# Altium schematic sheet AtoD_PART.SchDoc
size A4; SheetNumber: 3; SheetTotal: 3
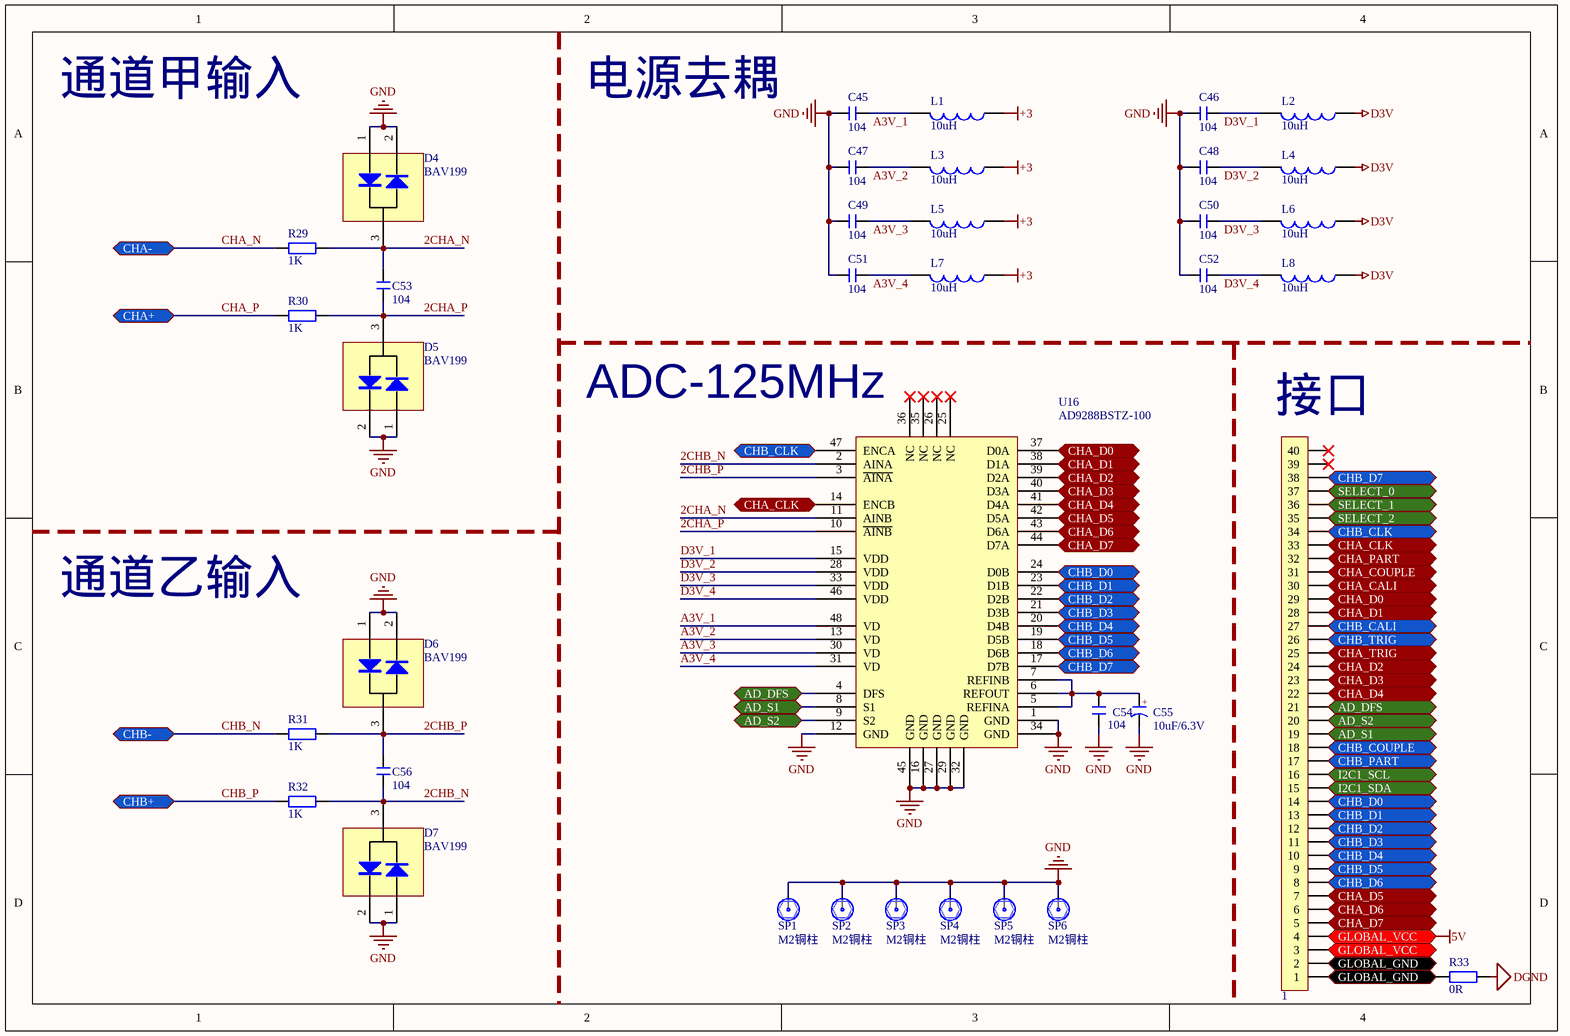
[diagram p0: AtoD_PART.SchDoc]

## Parts
1  FPC1.0-40P  [FPC0.5 2H-WS-40P]  (value not drawn)
C45  104  [C 0603_L]
C46  104  [C 0603_L]
C47  104  [C 0603_L]
C48  104  [C 0603_L]
C49  104  [C 0603_L]
C50  104  [C 0603_L]
C51  104  [C 0603_L]
C52  104  [C 0603_L]
C53  104  [C 0603_L]
C54  104  [C 0603_L]
C55  10uF/6.3V  [C 0603_L]
C56  104  [C 0603_L]
D4  BAV199  [SOT23-3L]
D5  BAV199  [SOT23-3L]
D6  BAV199  [SOT23-3L]
D7  BAV199  [SOT23-3L]
L1  10uH  [L 0603_L]
L2  10uH  [L 0603_L]
L3  10uH  [L 0603_L]
L4  10uH  [L 0603_L]
L5  10uH  [L 0603_L]
L6  10uH  [L 0603_L]
L7  10uH  [L 0603_L]
L8  10uH  [L 0603_L]
R29  1K  [R 0603_L]
R30  1K  [R 0603_L]
R31  1K  [R 0603_L]
R32  1K  [R 0603_L]
R33  0R  [R 0603_L]
SP1  M2铜柱  [M2]
SP2  M2铜柱  [M2]
SP3  M2铜柱  [M2]
SP4  M2铜柱  [M2]
SP5  M2铜柱  [M2]
SP6  M2铜柱  [M2]
U16  AD9288BSTZ-100  [TQFP48 7x7_L]

## Ports
AD_DFS (bidir), AD_S1 (bidir), AD_S2 (bidir), CHA+ (bidir), CHA- (bidir), CHA_CALI (bidir), CHA_CLK (bidir), CHA_COUPLE (bidir), CHA_D0 (bidir), CHA_D1 (bidir), CHA_D2 (bidir), CHA_D3 (bidir), CHA_D4 (bidir), CHA_D5 (bidir), CHA_D6 (bidir), CHA_D7 (bidir), CHA_PART (bidir), CHA_TRIG (bidir), CHB+ (bidir), CHB- (bidir), CHB_CALI (bidir), CHB_CLK (bidir), CHB_COUPLE (bidir), CHB_D0 (bidir), CHB_D1 (bidir), CHB_D2 (bidir), CHB_D3 (bidir), CHB_D4 (bidir), CHB_D5 (bidir), CHB_D6 (bidir), CHB_D7 (bidir), CHB_PART (bidir), CHB_TRIG (bidir), GLOBAL_GND (bidir), GLOBAL_VCC (bidir), I2C1_SCL (bidir), I2C1_SDA (bidir), SELECT_0 (bidir), SELECT_1 (bidir), SELECT_2 (bidir)

## Nets
5V: 1.3 1.4 ; port GLOBAL_VCC
+3: L1.1 L3.1 L5.1 L7.1
D3V: L2.1 L4.1 L6.1 L8.1
DGND: R33.1
GND: C45.1 C46.1 C47.1 C48.1 C49.1 C50.1 C51.1 C52.1 C54.1 C55.2(K) D4.1 D4.2 D5.1 D5.2 D6.1 D6.2 D7.1 D7.2 SP1.1 SP2.1 SP3.1 SP4.1 SP5.1 SP6.1 U16.1(GND) U16.12(GND) U16.16(GND) U16.27(GND) U16.29(GND) U16.32(GND) U16.34(GND) U16.45(GND)
2CHA_N: C53.1 D4.3 R29.2 U16.11(AINB)
2CHA_P: C53.2 D5.3 R30.2 U16.10(~{AINB})
2CHB_N: C56.2 D7.3 R32.2 U16.2(AINA)
2CHB_P: C56.1 D6.3 R31.2 U16.3(~{AINA})
A3V_1: C45.2 L1.2 U16.48(VD)
A3V_2: C47.2 L3.2 U16.13(VD)
A3V_3: C49.2 L5.2 U16.30(VD)
A3V_4: C51.2 L7.2 U16.31(VD)
AD_DFS: 1.21 U16.4(DFS) ; port AD_DFS
AD_S1: 1.19 U16.8(S1) ; port AD_S1
AD_S2: 1.20 U16.9(S2) ; port AD_S2
CHA_CALI: 1.30 ; port CHA_CALI
CHA_CLK: 1.33 U16.14(ENCB) ; port CHA_CLK
CHA_COUPLE: 1.31 ; port CHA_COUPLE
CHA_D0: 1.29 U16.37(D0A) ; port CHA_D0
CHA_D1: 1.28 U16.38(D1A) ; port CHA_D1
CHA_D2: 1.24 U16.39(D2A) ; port CHA_D2
CHA_D3: 1.23 U16.40(D3A) ; port CHA_D3
CHA_D4: 1.22 U16.41(D4A) ; port CHA_D4
CHA_D5: 1.7 U16.42(D5A) ; port CHA_D5
CHA_D6: 1.6 U16.43(D6A) ; port CHA_D6
CHA_D7: 1.5 U16.44(D7A) ; port CHA_D7
CHA_N: R29.1 ; port CHA-
CHA_P: R30.1 ; port CHA+
CHA_PART: 1.32 ; port CHA_PART
CHA_TRIG: 1.25 ; port CHA_TRIG
CHB_CALI: 1.27 ; port CHB_CALI
CHB_CLK: 1.34 U16.47(ENCA) ; port CHB_CLK
CHB_COUPLE: 1.18 ; port CHB_COUPLE
CHB_D0: 1.14 U16.24(D0B) ; port CHB_D0
CHB_D1: 1.13 U16.23(D1B) ; port CHB_D1
CHB_D2: 1.12 U16.22(D2B) ; port CHB_D2
CHB_D3: 1.11 U16.21(D3B) ; port CHB_D3
CHB_D4: 1.10 U16.20(D4B) ; port CHB_D4
CHB_D5: 1.9 U16.19(D5B) ; port CHB_D5
CHB_D6: 1.8 U16.18(D6B) ; port CHB_D6
CHB_D7: 1.38 U16.17(D7B) ; port CHB_D7
CHB_N: R31.1 ; port CHB-
CHB_P: R32.1 ; port CHB+
CHB_PART: 1.17 ; port CHB_PART
CHB_TRIG: 1.26 ; port CHB_TRIG
D3V_1: C46.2 L2.2 U16.15(VDD)
D3V_2: C48.2 L4.2 U16.28(VDD)
D3V_3: C50.2 L6.2 U16.33(VDD)
D3V_4: C52.2 L8.2 U16.46(VDD)
GLOBAL_GND: 1.1 1.2 R33.2 ; port GLOBAL_GND
I2C1_SCL: 1.16 ; port I2C1_SCL
I2C1_SDA: 1.15 ; port I2C1_SDA
SELECT_0: 1.37 ; port SELECT_0
SELECT_1: 1.36 ; port SELECT_1
SELECT_2: 1.35 ; port SELECT_2
NetC54_2: C54.2 C55.1(A) U16.5(REFINA) U16.6(REFOUT) U16.7(REFINB)

Not connected (* = marked no-connect by the designer): 1 39* 40*; U16 25(NC)* 26(NC)* 35(NC)* 36(NC)*

## Notes on the sheet
- 通道甲输入
- 电源去耦
- (near U16) ADC-125MHz
- (near 1) 接口
- 通道乙输入
- (in symbol C-CD) +

## Library data of the parts
1 = FPC-40P: FPC连接器; 版权归属: 源创客; BOM名称: FPC连接器; 学习资源: www.ooocke.com
C45-C54 C56 = C: 无极性贴片电容; 版权归属: 源创客; BOM名称: 无极性贴片电容; 学习资源: www.ooocke.com
C55 = C-CD: 贴片钽电容; 版权归属: 源创客; BOM名称: 贴片钽电容; 学习资源: www.ooocke.com
D4-D7 = BAV199: 双肖特基二极管; BOM名称: 肖特基二极管; 版权归属: 源创客; 属性: 40V/2A; 学习资源: www.ooocke.com
L1-L8 = L: 小功率贴片电感; 版权归属: 源创客; BOM名称: 小功率贴片电感; 学习资源: www.ooocke.com
R29-R33 = R: 贴片电阻; 版权归属: 源创客; BOM名称: 贴片电阻; 学习资源: www.ooocke.com
SP1-SP6 = M2铜柱: BOM名称: 铜柱; 版权归属: 源创客; 学习资源: www.ooocke.com
U16 = AD9288BSTZ-100: 并行双通道高速ADC